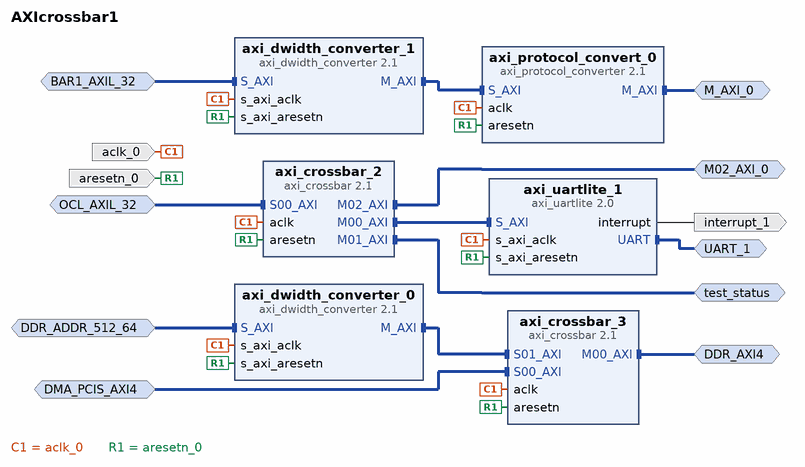
[diagram p0: block diagram of the top level]
# Vivado block design AXIcrossbar1, xcvu9p-flga2104-1-e, Vivado 2021.1
create_bd_design AXIcrossbar1

create_bd_intf_port -mode Master -vlnv xilinx.com:interface:aximm_rtl:1.0 test_status
set_property -dict [list \
  CONFIG.ADDR_WIDTH 32 \
  CONFIG.DATA_WIDTH 32 \
  CONFIG.FREQ_HZ 10000000 \
  CONFIG.NUM_READ_OUTSTANDING 2 \
  CONFIG.NUM_WRITE_OUTSTANDING 2 \
  CONFIG.PROTOCOL AXI4LITE \
] [get_bd_intf_ports test_status]
create_bd_intf_port -mode Slave -vlnv xilinx.com:interface:aximm_rtl:1.0 OCL_AXIL_32
set_property -dict [list \
  CONFIG.ADDR_WIDTH 32 \
  CONFIG.ARUSER_WIDTH 0 \
  CONFIG.AWUSER_WIDTH 0 \
  CONFIG.BUSER_WIDTH 0 \
  CONFIG.DATA_WIDTH 32 \
  CONFIG.FREQ_HZ 10000000 \
  CONFIG.HAS_BRESP 1 \
  CONFIG.HAS_BURST 1 \
  CONFIG.HAS_CACHE 1 \
  CONFIG.HAS_LOCK 1 \
  CONFIG.HAS_PROT 1 \
  CONFIG.HAS_QOS 1 \
  CONFIG.HAS_REGION 0 \
  CONFIG.HAS_RRESP 1 \
  CONFIG.HAS_WSTRB 1 \
  CONFIG.ID_WIDTH 0 \
  CONFIG.MAX_BURST_LENGTH 1 \
  CONFIG.NUM_READ_OUTSTANDING 2 \
  CONFIG.NUM_READ_THREADS 1 \
  CONFIG.NUM_WRITE_OUTSTANDING 2 \
  CONFIG.NUM_WRITE_THREADS 1 \
  CONFIG.PROTOCOL AXI4LITE \
  CONFIG.READ_WRITE_MODE READ_WRITE \
  CONFIG.RUSER_BITS_PER_BYTE 0 \
  CONFIG.RUSER_WIDTH 0 \
  CONFIG.SUPPORTS_NARROW_BURST 0 \
  CONFIG.WUSER_BITS_PER_BYTE 0 \
  CONFIG.WUSER_WIDTH 0 \
] [get_bd_intf_ports OCL_AXIL_32]
create_bd_intf_port -mode Slave -vlnv xilinx.com:interface:aximm_rtl:1.0 DMA_PCIS_AXI4
set_property -dict [list \
  CONFIG.ADDR_WIDTH 64 \
  CONFIG.ARUSER_WIDTH 0 \
  CONFIG.AWUSER_WIDTH 0 \
  CONFIG.BUSER_WIDTH 0 \
  CONFIG.DATA_WIDTH 512 \
  CONFIG.FREQ_HZ 10000000 \
  CONFIG.HAS_BRESP 1 \
  CONFIG.HAS_BURST 1 \
  CONFIG.HAS_CACHE 1 \
  CONFIG.HAS_LOCK 1 \
  CONFIG.HAS_PROT 1 \
  CONFIG.HAS_QOS 1 \
  CONFIG.HAS_REGION 0 \
  CONFIG.HAS_RRESP 1 \
  CONFIG.HAS_WSTRB 1 \
  CONFIG.ID_WIDTH 6 \
  CONFIG.MAX_BURST_LENGTH 256 \
  CONFIG.NUM_READ_OUTSTANDING 2 \
  CONFIG.NUM_READ_THREADS 1 \
  CONFIG.NUM_WRITE_OUTSTANDING 2 \
  CONFIG.NUM_WRITE_THREADS 1 \
  CONFIG.PROTOCOL AXI4 \
  CONFIG.READ_WRITE_MODE READ_WRITE \
  CONFIG.RUSER_BITS_PER_BYTE 0 \
  CONFIG.RUSER_WIDTH 0 \
  CONFIG.SUPPORTS_NARROW_BURST 1 \
  CONFIG.WUSER_BITS_PER_BYTE 0 \
  CONFIG.WUSER_WIDTH 0 \
] [get_bd_intf_ports DMA_PCIS_AXI4]
create_bd_intf_port -mode Slave -vlnv xilinx.com:interface:aximm_rtl:1.0 DDR_ADDR_512_64
set_property -dict [list \
  CONFIG.ADDR_WIDTH 64 \
  CONFIG.ARUSER_WIDTH 0 \
  CONFIG.AWUSER_WIDTH 0 \
  CONFIG.BUSER_WIDTH 0 \
  CONFIG.DATA_WIDTH 64 \
  CONFIG.FREQ_HZ 10000000 \
  CONFIG.HAS_BRESP 1 \
  CONFIG.HAS_BURST 1 \
  CONFIG.HAS_CACHE 1 \
  CONFIG.HAS_LOCK 1 \
  CONFIG.HAS_PROT 1 \
  CONFIG.HAS_QOS 1 \
  CONFIG.HAS_REGION 1 \
  CONFIG.HAS_RRESP 1 \
  CONFIG.HAS_WSTRB 1 \
  CONFIG.ID_WIDTH 16 \
  CONFIG.MAX_BURST_LENGTH 256 \
  CONFIG.NUM_READ_OUTSTANDING 2 \
  CONFIG.NUM_READ_THREADS 1 \
  CONFIG.NUM_WRITE_OUTSTANDING 2 \
  CONFIG.NUM_WRITE_THREADS 1 \
  CONFIG.PROTOCOL AXI4 \
  CONFIG.READ_WRITE_MODE READ_WRITE \
  CONFIG.RUSER_BITS_PER_BYTE 0 \
  CONFIG.RUSER_WIDTH 0 \
  CONFIG.SUPPORTS_NARROW_BURST 1 \
  CONFIG.WUSER_BITS_PER_BYTE 0 \
  CONFIG.WUSER_WIDTH 0 \
] [get_bd_intf_ports DDR_ADDR_512_64]
create_bd_intf_port -mode Master -vlnv xilinx.com:interface:uart_rtl:1.0 UART_1
create_bd_intf_port -mode Master -vlnv xilinx.com:interface:aximm_rtl:1.0 M02_AXI_0
set_property -dict [list \
  CONFIG.ADDR_WIDTH 32 \
  CONFIG.DATA_WIDTH 32 \
  CONFIG.FREQ_HZ 10000000 \
  CONFIG.HAS_BURST 0 \
  CONFIG.HAS_CACHE 0 \
  CONFIG.HAS_LOCK 0 \
  CONFIG.HAS_QOS 0 \
  CONFIG.HAS_REGION 0 \
  CONFIG.PROTOCOL AXI4LITE \
] [get_bd_intf_ports M02_AXI_0]
create_bd_intf_port -mode Master -vlnv xilinx.com:interface:aximm_rtl:1.0 M_AXI_0
set_property -dict [list \
  CONFIG.ADDR_WIDTH 64 \
  CONFIG.DATA_WIDTH 64 \
  CONFIG.FREQ_HZ 10000000 \
  CONFIG.PROTOCOL AXI4 \
] [get_bd_intf_ports M_AXI_0]
create_bd_intf_port -mode Slave -vlnv xilinx.com:interface:aximm_rtl:1.0 BAR1_AXIL_32
set_property -dict [list \
  CONFIG.ADDR_WIDTH 64 \
  CONFIG.ARUSER_WIDTH 0 \
  CONFIG.AWUSER_WIDTH 0 \
  CONFIG.BUSER_WIDTH 0 \
  CONFIG.DATA_WIDTH 32 \
  CONFIG.FREQ_HZ 10000000 \
  CONFIG.HAS_BRESP 1 \
  CONFIG.HAS_BURST 0 \
  CONFIG.HAS_CACHE 0 \
  CONFIG.HAS_LOCK 0 \
  CONFIG.HAS_PROT 1 \
  CONFIG.HAS_QOS 0 \
  CONFIG.HAS_REGION 0 \
  CONFIG.HAS_RRESP 1 \
  CONFIG.HAS_WSTRB 1 \
  CONFIG.ID_WIDTH 0 \
  CONFIG.MAX_BURST_LENGTH 1 \
  CONFIG.NUM_READ_OUTSTANDING 1 \
  CONFIG.NUM_READ_THREADS 1 \
  CONFIG.NUM_WRITE_OUTSTANDING 1 \
  CONFIG.NUM_WRITE_THREADS 1 \
  CONFIG.PROTOCOL AXI4LITE \
  CONFIG.READ_WRITE_MODE READ_WRITE \
  CONFIG.RUSER_BITS_PER_BYTE 0 \
  CONFIG.RUSER_WIDTH 0 \
  CONFIG.SUPPORTS_NARROW_BURST 0 \
  CONFIG.WUSER_BITS_PER_BYTE 0 \
  CONFIG.WUSER_WIDTH 0 \
] [get_bd_intf_ports BAR1_AXIL_32]
create_bd_intf_port -mode Master -vlnv xilinx.com:interface:aximm_rtl:1.0 DDR_AXI4
set_property -dict [list \
  CONFIG.ADDR_WIDTH 64 \
  CONFIG.DATA_WIDTH 512 \
  CONFIG.FREQ_HZ 10000000 \
  CONFIG.NUM_READ_OUTSTANDING 2 \
  CONFIG.NUM_WRITE_OUTSTANDING 2 \
  CONFIG.PROTOCOL AXI4 \
] [get_bd_intf_ports DDR_AXI4]
create_bd_port -dir O -type intr interrupt_1
create_bd_port -dir I -type rst aresetn_0
create_bd_port -dir I -type clk aclk_0
set_property -dict [list \
  CONFIG.ASSOCIATED_BUSIF test_status:OCL_AXIL_32:DMA_PCIS_AXI4:DDR_ADDR_512_64:M02_AXI_0:M_AXI_0:BAR1_AXIL_32:DDR_AXI4 \
  CONFIG.FREQ_HZ 10000000 \
] [get_bd_ports aclk_0]

create_bd_cell -type ip -vlnv xilinx.com:ip:axi_crossbar:2.1 axi_crossbar_2
set_property -dict [list \
  CONFIG.ADDR_WIDTH 32 \
  CONFIG.DATA_WIDTH 32 \
  CONFIG.NUM_MI 3 \
  CONFIG.NUM_SI 1 \
  CONFIG.PROTOCOL AXI4LITE \
  CONFIG.R_REGISTER 1 \
] [get_bd_cells axi_crossbar_2]
create_bd_cell -type ip -vlnv xilinx.com:ip:axi_uartlite:2.0 axi_uartlite_1
create_bd_cell -type ip -vlnv xilinx.com:ip:axi_crossbar:2.1 axi_crossbar_3
set_property -dict [list \
  CONFIG.ADDR_RANGES 1 \
  CONFIG.ADDR_WIDTH 64 \
  CONFIG.DATA_WIDTH 512 \
  CONFIG.ID_WIDTH 16 \
  CONFIG.M00_A00_ADDR_WIDTH 24 \
  CONFIG.M00_A00_BASE_ADDR 0x0000000000000000 \
  CONFIG.NUM_MI 1 \
  CONFIG.NUM_SI 2 \
  CONFIG.S01_BASE_ID 0x00008000 \
  CONFIG.S02_BASE_ID 0x00010000 \
  CONFIG.S03_BASE_ID 0x00018000 \
  CONFIG.S04_BASE_ID 0x00020000 \
  CONFIG.S05_BASE_ID 0x00028000 \
  CONFIG.S06_BASE_ID 0x00030000 \
  CONFIG.S07_BASE_ID 0x00038000 \
  CONFIG.S08_BASE_ID 0x00040000 \
  CONFIG.S09_BASE_ID 0x00048000 \
  CONFIG.S10_BASE_ID 0x00050000 \
  CONFIG.S11_BASE_ID 0x00058000 \
  CONFIG.S12_BASE_ID 0x00060000 \
  CONFIG.S13_BASE_ID 0x00068000 \
  CONFIG.S14_BASE_ID 0x00070000 \
  CONFIG.S15_BASE_ID 0x00078000 \
] [get_bd_cells axi_crossbar_3]
create_bd_cell -type ip -vlnv xilinx.com:ip:axi_dwidth_converter:2.1 axi_dwidth_converter_1
set_property -dict [list \
  CONFIG.ADDR_WIDTH 64 \
  CONFIG.MI_DATA_WIDTH 64 \
  CONFIG.PROTOCOL AXI4LITE \
  CONFIG.SI_DATA_WIDTH 32 \
  CONFIG.SI_ID_WIDTH 0 \
] [get_bd_cells axi_dwidth_converter_1]
create_bd_cell -type ip -vlnv xilinx.com:ip:axi_protocol_converter:2.1 axi_protocol_convert_0
set_property -dict [list \
  CONFIG.ADDR_WIDTH 64 \
  CONFIG.DATA_WIDTH 64 \
  CONFIG.MI_PROTOCOL AXI4 \
  CONFIG.SI_PROTOCOL AXI4LITE \
  CONFIG.TRANSLATION_MODE 2 \
] [get_bd_cells axi_protocol_convert_0]
create_bd_cell -type ip -vlnv xilinx.com:ip:axi_dwidth_converter:2.1 axi_dwidth_converter_0
set_property -dict [list \
  CONFIG.ADDR_WIDTH 64 \
  CONFIG.MAX_SPLIT_BEATS 16 \
  CONFIG.MI_DATA_WIDTH 512 \
  CONFIG.SI_DATA_WIDTH 64 \
  CONFIG.SI_ID_WIDTH 16 \
] [get_bd_cells axi_dwidth_converter_0]

# ---- connections ----

connect_bd_intf_net -intf_net DDR_ADDR_512_64_1 [get_bd_intf_ports DDR_ADDR_512_64] [get_bd_intf_pins axi_dwidth_converter_0/S_AXI]
connect_bd_intf_net [get_bd_intf_ports OCL_AXIL_32] [get_bd_intf_pins axi_crossbar_2/S00_AXI]
connect_bd_intf_net -intf_net S00_AXI_1_1 [get_bd_intf_ports DMA_PCIS_AXI4] [get_bd_intf_pins axi_crossbar_3/S00_AXI]
connect_bd_intf_net -intf_net S_AXI_0_2 [get_bd_intf_ports BAR1_AXIL_32] [get_bd_intf_pins axi_dwidth_converter_1/S_AXI]
connect_bd_intf_net -intf_net axi_crossbar_0_M01_AXI [get_bd_intf_ports test_status] [get_bd_intf_pins axi_crossbar_2/M01_AXI]
connect_bd_intf_net [get_bd_intf_pins axi_uartlite_1/S_AXI] [get_bd_intf_pins axi_crossbar_2/M00_AXI]
connect_bd_intf_net [get_bd_intf_ports M02_AXI_0] [get_bd_intf_pins axi_crossbar_2/M02_AXI]
connect_bd_intf_net [get_bd_intf_ports DDR_AXI4] [get_bd_intf_pins axi_crossbar_3/M00_AXI]
connect_bd_intf_net [get_bd_intf_pins axi_dwidth_converter_0/M_AXI] [get_bd_intf_pins axi_crossbar_3/S01_AXI]
connect_bd_intf_net [get_bd_intf_pins axi_protocol_convert_0/S_AXI] [get_bd_intf_pins axi_dwidth_converter_1/M_AXI]
connect_bd_intf_net [get_bd_intf_ports M_AXI_0] [get_bd_intf_pins axi_protocol_convert_0/M_AXI]
connect_bd_intf_net [get_bd_intf_ports UART_1] [get_bd_intf_pins axi_uartlite_1/UART]
connect_bd_net -net aclk_0_1 [get_bd_ports aclk_0] \
  [get_bd_pins axi_crossbar_2/aclk] [get_bd_pins axi_uartlite_1/s_axi_aclk] [get_bd_pins axi_crossbar_3/aclk] \
  [get_bd_pins axi_dwidth_converter_1/s_axi_aclk] [get_bd_pins axi_protocol_convert_0/aclk] \
  [get_bd_pins axi_dwidth_converter_0/s_axi_aclk]
connect_bd_net -net aresetn_0_1 [get_bd_ports aresetn_0] \
  [get_bd_pins axi_crossbar_2/aresetn] [get_bd_pins axi_uartlite_1/s_axi_aresetn] [get_bd_pins axi_crossbar_3/aresetn] \
  [get_bd_pins axi_dwidth_converter_1/s_axi_aresetn] [get_bd_pins axi_protocol_convert_0/aresetn] \
  [get_bd_pins axi_dwidth_converter_0/s_axi_aresetn]
connect_bd_net -net axi_uartlite_0_interrupt [get_bd_pins axi_uartlite_1/interrupt] [get_bd_ports interrupt_1]

# ---- address map ----
assign_bd_address -offset 0x0000000044A00000 -range 64K -target_address_space [get_bd_addr_spaces BAR1_AXIL_32] [get_bd_addr_segs M_AXI_0/Reg]
assign_bd_address -offset 0x0000000000000000 -range 256M -target_address_space [get_bd_addr_spaces DDR_ADDR_512_64] [get_bd_addr_segs DDR_AXI4/Reg]
assign_bd_address -offset 0x0000000000000000 -range 256M -target_address_space [get_bd_addr_spaces DMA_PCIS_AXI4] [get_bd_addr_segs DDR_AXI4/Reg]
assign_bd_address -offset 0x00000000 -range 512K -target_address_space [get_bd_addr_spaces OCL_AXIL_32] [get_bd_addr_segs axi_uartlite_1/S_AXI/Reg]
assign_bd_address -offset 0x00080000 -range 512K -target_address_space [get_bd_addr_spaces OCL_AXIL_32] [get_bd_addr_segs test_status/Reg]
assign_bd_address -offset 0x00100000 -range 512K -target_address_space [get_bd_addr_spaces OCL_AXIL_32] [get_bd_addr_segs M02_AXI_0/Reg]

validate_bd_design
save_bd_design
